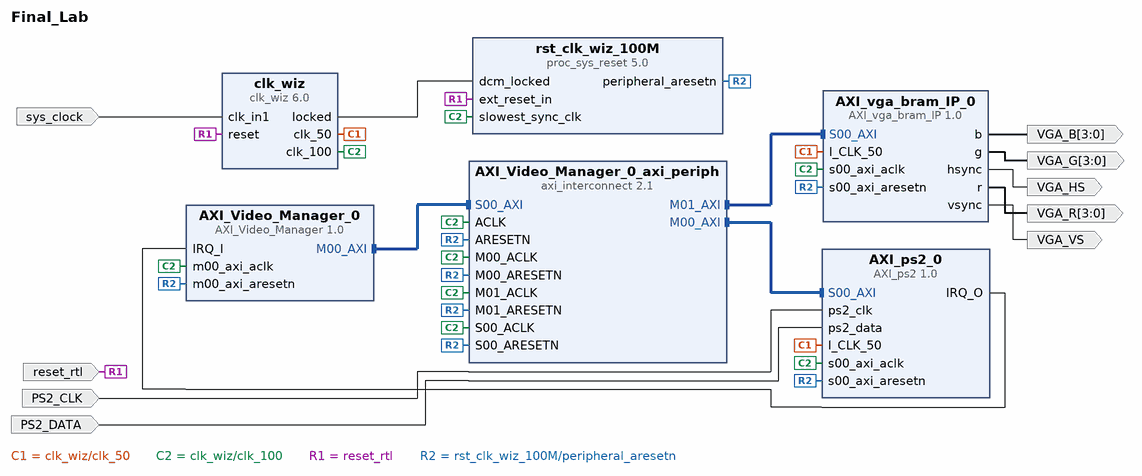
[diagram p0: block diagram of the top level]
# Vivado block design Final_Lab, xc7z007sclg400-1, Vivado 2022.2
create_bd_design Final_Lab

create_bd_port -dir O -from 3 -to 0 VGA_B
create_bd_port -dir O -from 3 -to 0 VGA_G
create_bd_port -dir O VGA_HS
create_bd_port -dir O -from 3 -to 0 VGA_R
create_bd_port -dir O VGA_VS
create_bd_port -dir I -type clk sys_clock
set_property -dict {CONFIG.FREQ_HZ 125000000 CONFIG.PHASE 0.0} [get_bd_ports sys_clock]
create_bd_port -dir I -type rst reset_rtl
set_property -dict {CONFIG.POLARITY ACTIVE_HIGH} [get_bd_ports reset_rtl]
create_bd_port -dir I PS2_CLK
create_bd_port -dir I PS2_DATA

create_bd_cell -type ip -vlnv solathomas.com:Project_6:AXI_ps2:1.0 AXI_ps2_0
create_bd_cell -type ip -vlnv solathomas.com:Project_6:AXI_vga_bram_IP:1.0 AXI_vga_bram_IP_0
create_bd_cell -type ip -vlnv xilinx.com:ip:axi_interconnect:2.1 AXI_Video_Manager_0_axi_periph
set_property -dict {CONFIG.NUM_MI 2} [get_bd_cells AXI_Video_Manager_0_axi_periph]
create_bd_cell -type ip -vlnv xilinx.com:ip:clk_wiz:6.0 clk_wiz
set_property -dict [list \
  CONFIG.CLKIN1_JITTER_PS 80.0 \
  CONFIG.CLKOUT1_JITTER 124.615 \
  CONFIG.CLKOUT1_PHASE_ERROR 96.948 \
  CONFIG.CLKOUT2_JITTER 143.688 \
  CONFIG.CLKOUT2_PHASE_ERROR 96.948 \
  CONFIG.CLKOUT2_REQUESTED_OUT_FREQ 50 \
  CONFIG.CLKOUT2_USED true \
  CONFIG.CLK_IN1_BOARD_INTERFACE sys_clock \
  CONFIG.CLK_OUT1_PORT clk_100 \
  CONFIG.CLK_OUT2_PORT clk_50 \
  CONFIG.MMCM_CLKFBOUT_MULT_F 8.000 \
  CONFIG.MMCM_CLKIN1_PERIOD 8.000 \
  CONFIG.MMCM_CLKOUT1_DIVIDE 20 \
  CONFIG.NUM_OUT_CLKS 2 \
  CONFIG.USE_BOARD_FLOW true \
] [get_bd_cells clk_wiz]
create_bd_cell -type ip -vlnv xilinx.com:ip:proc_sys_reset:5.0 rst_clk_wiz_100M
create_bd_cell -type ip -vlnv solathomas.com:Project_6:AXI_Video_Manager:1.0 AXI_Video_Manager_0

# ---- connections ----

connect_bd_intf_net [get_bd_intf_pins AXI_Video_Manager_0/M00_AXI] [get_bd_intf_pins AXI_Video_Manager_0_axi_periph/S00_AXI]
connect_bd_intf_net [get_bd_intf_pins AXI_Video_Manager_0_axi_periph/M00_AXI] [get_bd_intf_pins AXI_ps2_0/S00_AXI]
connect_bd_intf_net [get_bd_intf_pins AXI_Video_Manager_0_axi_periph/M01_AXI] [get_bd_intf_pins AXI_vga_bram_IP_0/S00_AXI]
connect_bd_net [get_bd_pins AXI_ps2_0/IRQ_O] [get_bd_pins AXI_Video_Manager_0/IRQ_I]
connect_bd_net [get_bd_pins AXI_vga_bram_IP_0/b] [get_bd_ports VGA_B]
connect_bd_net [get_bd_pins AXI_vga_bram_IP_0/g] [get_bd_ports VGA_G]
connect_bd_net [get_bd_pins AXI_vga_bram_IP_0/hsync] [get_bd_ports VGA_HS]
connect_bd_net [get_bd_pins AXI_vga_bram_IP_0/r] [get_bd_ports VGA_R]
connect_bd_net [get_bd_pins AXI_vga_bram_IP_0/vsync] [get_bd_ports VGA_VS]
connect_bd_net [get_bd_ports PS2_CLK] [get_bd_pins AXI_ps2_0/ps2_clk]
connect_bd_net [get_bd_ports PS2_DATA] [get_bd_pins AXI_ps2_0/ps2_data]
connect_bd_net [get_bd_pins clk_wiz/clk_50] [get_bd_pins AXI_ps2_0/I_CLK_50] [get_bd_pins AXI_vga_bram_IP_0/I_CLK_50]
connect_bd_net -net clk_wiz_clk_out1 [get_bd_pins clk_wiz/clk_100] \
  [get_bd_pins AXI_Video_Manager_0_axi_periph/S00_ACLK] [get_bd_pins rst_clk_wiz_100M/slowest_sync_clk] \
  [get_bd_pins AXI_ps2_0/s00_axi_aclk] [get_bd_pins AXI_Video_Manager_0_axi_periph/M00_ACLK] \
  [get_bd_pins AXI_Video_Manager_0_axi_periph/ACLK] [get_bd_pins AXI_vga_bram_IP_0/s00_axi_aclk] \
  [get_bd_pins AXI_Video_Manager_0_axi_periph/M01_ACLK] [get_bd_pins AXI_Video_Manager_0/m00_axi_aclk]
connect_bd_net [get_bd_pins clk_wiz/locked] [get_bd_pins rst_clk_wiz_100M/dcm_locked]
connect_bd_net [get_bd_ports reset_rtl] [get_bd_pins clk_wiz/reset] [get_bd_pins rst_clk_wiz_100M/ext_reset_in]
connect_bd_net [get_bd_pins rst_clk_wiz_100M/peripheral_aresetn] \
  [get_bd_pins AXI_Video_Manager_0_axi_periph/S00_ARESETN] [get_bd_pins AXI_ps2_0/s00_axi_aresetn] \
  [get_bd_pins AXI_Video_Manager_0_axi_periph/M00_ARESETN] [get_bd_pins AXI_Video_Manager_0_axi_periph/ARESETN] \
  [get_bd_pins AXI_vga_bram_IP_0/s00_axi_aresetn] [get_bd_pins AXI_Video_Manager_0_axi_periph/M01_ARESETN] \
  [get_bd_pins AXI_Video_Manager_0/m00_axi_aresetn]
connect_bd_net [get_bd_ports sys_clock] [get_bd_pins clk_wiz/clk_in1]

# ---- address map ----
assign_bd_address -offset 0x44A00000 -range 64K -target_address_space [get_bd_addr_spaces AXI_Video_Manager_0/M00_AXI] [get_bd_addr_segs AXI_ps2_0/S00_AXI/S00_AXI_reg]
assign_bd_address -offset 0x44A10000 -range 64K -target_address_space [get_bd_addr_spaces AXI_Video_Manager_0/M00_AXI] [get_bd_addr_segs AXI_vga_bram_IP_0/S00_AXI/S00_AXI_reg]

validate_bd_design
save_bd_design
